# EAGLE design rapidshark-main-breakout-top-mk-1.10 (EAGLE 6.5.0)
AUTHOR: sean@yak.net
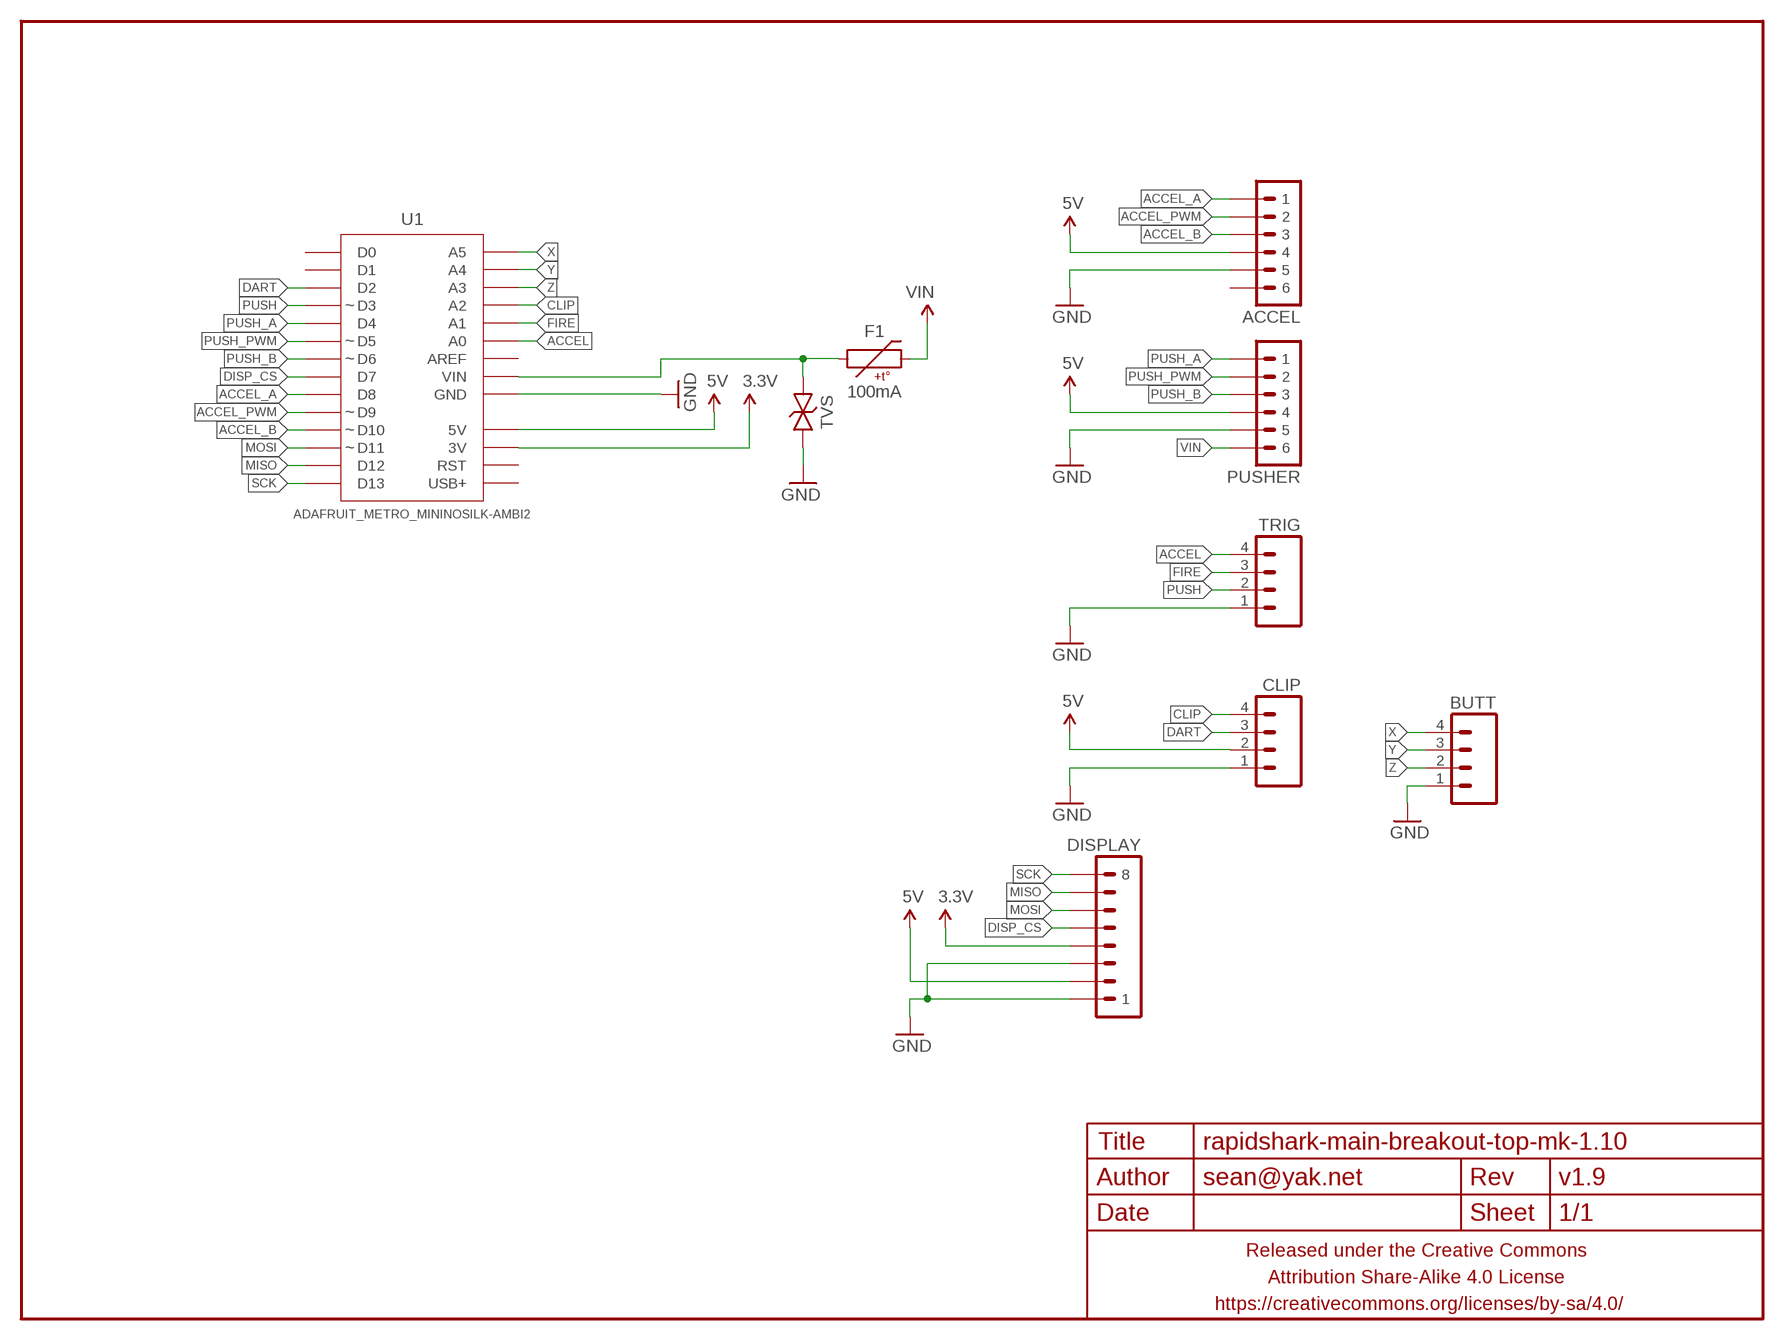
[diagram p0: schematic, sheet 1]

## Parts
ACCEL  M06JST-PH-PTH-VERT  [JST-6-PH-VERT-PTH]
BUTT  M04JST-PTH-VERT  [JST-4-PH-VERT-PTH]
CLIP  M04JST-PTH-VERT  [JST-4-PH-VERT-PTH]
DISPLAY  M08JST-PH-VERT-PTH  [JST-8-VERT-PTH]
F1  100mA  PTCSMD  [PTC-1206]
FRAME1  FRAME-LETTERNO_PACKAGE  [DUMMY]
PUSHER  M06JST-PH-PTH-VERT  [JST-6-PH-VERT-PTH]
TRIG  M04JST-PTH-VERT  [JST-4-PH-VERT-PTH]
TVS  TVSSMA  [SMA-DIODE-TVS-BIDIR]
U1  ADAFRUIT_METRO_MININOSILK-AMBI2  [ADAFRUIT_METRO_MINI_BACK]

## Nets
3.3V: DISPLAY.4 U1.17(3V)
5V: ACCEL.4 CLIP.2 DISPLAY.2 PUSHER.4 U1.18(5V)
ACCEL: TRIG.4 U1.23(A0)
ACCEL_A: ACCEL.1 U1.9(D8)
ACCEL_B: ACCEL.3 U1.11(D10)
ACCEL_PWM: ACCEL.2 U1.10(D9)
CLIP: CLIP.4 U1.25(A2)
DART: CLIP.3 U1.3(D2)
DISP_CS: DISPLAY.5 U1.8(D7)
FIRE: TRIG.3 U1.24(A1)
GND: ACCEL.5 BUTT.1 CLIP.1 DISPLAY.1 DISPLAY.3 PUSHER.5 TRIG.1 TVS.1 U1.19(GND) U1.20(GND)
MISO: DISPLAY.7 U1.13(D12)
MOSI: DISPLAY.6 U1.12(D11)
N$1: F1.1 TVS.2 U1.21(VIN)
PUSH: TRIG.2 U1.4(D3)
PUSH_A: PUSHER.1 U1.5(D4)
PUSH_B: PUSHER.3 U1.7(D6)
PUSH_PWM: PUSHER.2 U1.6(D5)
SCK: DISPLAY.8 U1.14(D13)
VIN: F1.2 PUSHER.6
X: BUTT.4 U1.28(A5)
Y: BUTT.3 U1.27(A4)
Z: BUTT.2 U1.26(A3)
Unconnected: ACCEL.6 U1.1(D0) U1.2(D1) U1.15(USB+) U1.16(RST) U1.22(AREF)

## Library data of the parts
ACCEL PUSHER = A_butts:M06: Header 6 Standard 6-pin 0.1" header. Use with straight break away headers (SKU : PRT-00116), right angle break away headers (PRT-00553), swiss pins (PRT-00743), machine pins (PRT-00117), and female headers (PRT-00115). Molex polarized connector foot print use with SKU : PRT-08094 with associated crimp pins and housings. NOTES ON THE VARIANTS LOCK and LOCK_LONGPADS... This footprint was designed to help hold the alignment of a through-hole component (i.e. 6-pin header) while soldering it into place. You may notice that each hole has been shifted either up or down by 0.005 of an inch from it's more standard position (which is a perfectly straight line). This slight alteration caused the pins (the squares in the middle) to touch the edges of the holes. Because they are alternating, it causes a "brace" to hold the component in place. 0.005 has proven to be the perfect amount of "off-center" position when using our standard breakaway headers. Although looks a little odd when you look at the bare footprint, once you have a header in there, the alteration is very hard to notice. Also,if you push a header all the way into place, it is covered up entirely on the bottom side. This idea of altering the position of holes to aid alignment will be further integrated into the Sparkfun Library for other footprints. It can help hold any component with 3 or more connection pins.
BUTT CLIP TRIG = A_butts:M04: Header 4 Standard 4-pin 0.1" header. Use with straight break away headers (SKU : PRT-00116), right angle break away headers (PRT-00553), swiss pins (PRT-00743), machine pins (PRT-00117), and female headers (PRT-00115). Molex polarized connector foot print use with SKU : PRT-08231 with associated crimp pins and housings. 1MM SMD Version SKU: PRT-10208
DISPLAY = A_butts:M08: Header 8 Standard 8-pin 0.1" header. Use with straight break away headers (SKU : PRT-00116), right angle break away headers (PRT-00553), swiss pins (PRT-00743), machine pins (PRT-00117), and female headers (PRT-00115).
F1 = A_butts:PTC: Resettable Fuse PTC Resettable Fuse. Spark Fun Electronics SKU : COM-08357; PROD_ID: RES-11150
FRAME1 = A_butts:FRAME-LETTER: Schematic Frame Standard 8.5x11 US Letter frame; DESIGNER: sean@yak.net; VERSION: v1.9
TVS = A_butts:TVS: Transient voltage suppressor- prevents ESD on inputs. Ignore package description- MBRA140 is NOT this type of part!!!
U1 = A_butts:ADAFRUIT_METRO_MINI

## Board
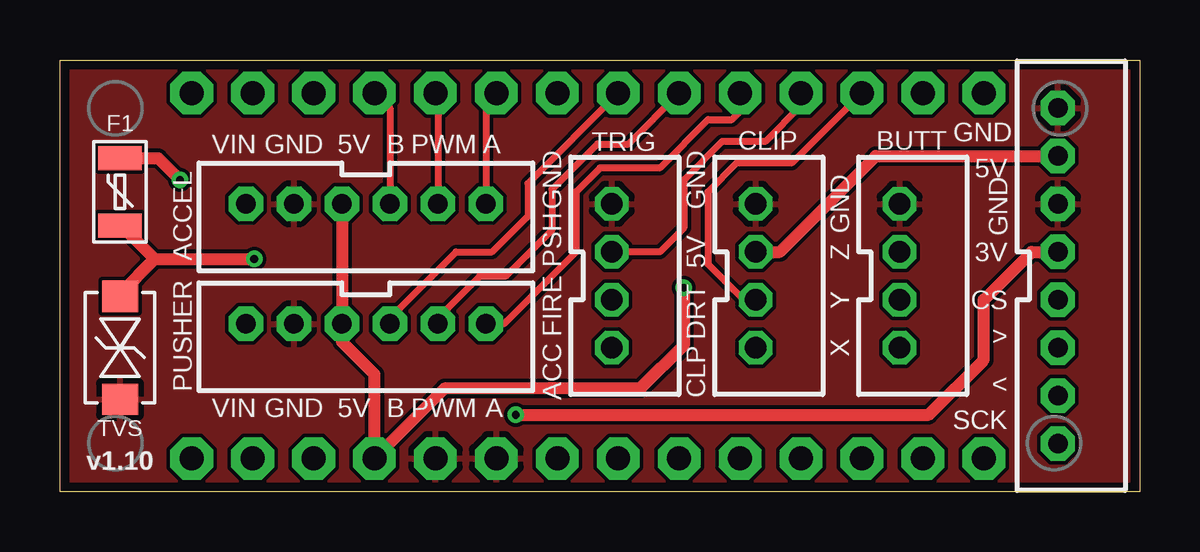
[diagram p1: board, top side]
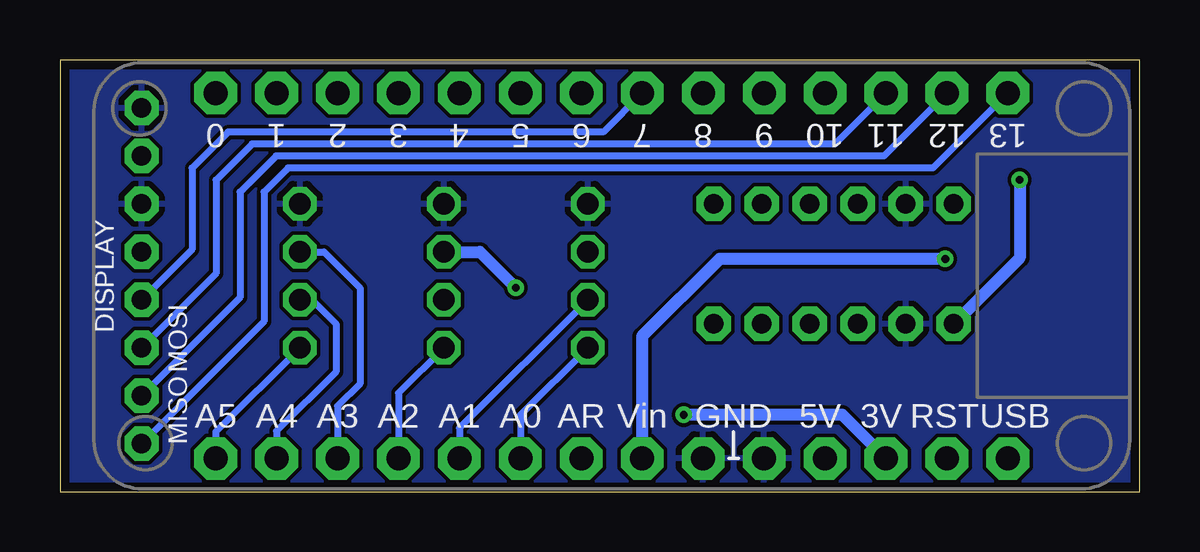
[diagram p2: board, bottom side, seen from below]

Size 45 x 18 mm. Coordinates in mm from the lower left corner, seen from the top.
Outline: 45,18 45,0 0,0 0,18 45,18
Copper layers (1*16): Top 0.0356mm / dielectric 1.5011mm / Bottom 0.0356mm
Design rules "LaenPCBOrder_2": minimum track width 6mil, minimum drill 13mil, track to track 6mil, track to pad 6mil, pad to pad 6mil, via to via 6mil, smd to smd 6mil, copper to edge 15mil, drill to drill 6mil, minimum pad ring 7mil, minimum via ring 7mil, stop-mask expansion 3mil, vias tented up to drill 20mil, thermal gap 10mil

### Footprints (pad centres in the part's own frame; a part is rotated, then mirrored left to right if it is on the bottom)
JST-6-PH-VERT-PTH = drill 0.8 pad 1.422 octagon: 1 -5,0; 2 -3,0; 3 -1,0; 4 1,0; 5 3,0; 6 5,0
JST-4-PH-VERT-PTH = drill 0.9 pad 1.4 octagon: 1 0,0; 2 2,0; 3 4,0; 4 6,0
JST-8-VERT-PTH = drill 0.8 pad 1.422 octagon: 1 -7,0; 2 -5,0; 3 -3,0; 4 -1,0; 5 1,0; 6 3,0; 7 5,0; 8 7,0
PTC-1206 = smd 1 x 1.8: 1 -1.4,0; 2 1.4,0
SMA-DIODE-TVS-BIDIR = smd 1.3 x 1.5: 1 -2.15,0; 2 2.15,0
ADAFRUIT_METRO_MINI_BACK = drill 1 pad 1.778 octagon: 1 16.51,7.62; 2 13.97,7.62; 3 11.43,7.62; 4 8.89,7.62; 5 6.35,7.62; 6 3.81,7.62; 7 1.27,7.62; 8 -1.27,7.62; 9 -3.81,7.62; 10 -6.35,7.62; 11 -8.89,7.62; 12 -11.43,7.62; 13 -13.97,7.62; 14 -16.51,7.62; 15 -16.51,-7.62; 16 -13.97,-7.62; 17 -11.43,-7.62; 18 -8.89,-7.62; 19 -6.35,-7.62; 20 -3.81,-7.62; 21 -1.27,-7.62; 22 1.27,-7.62; 23 3.81,-7.62; 24 6.35,-7.62; 25 8.89,-7.62; 26 11.43,-7.62; 27 13.97,-7.62; 28 16.51,-7.62

### Placement (x,y rotation side)
ACCEL  12.75,12 180 top
BUTT  35,12 270 top
CLIP  29,12 270 top
DISPLAY  41.6,9 270 top
F1  2.5,12.5 90 top
FRAME1  0,0 270 bottom
PUSHER  12.75,7 180 top
TRIG  23,12 270 top
TVS  2.5,6 90 top
U1  22,9 0 top

### Tracks (layer width: path | path; a pad name or v marks a point on that pad's centre or on a via)
3.3V  (via drill 0.33)
  Top 0.5: v19,3.2 36.2,3.2 38.5,5.5 38.5,8 40.5,10 DISPLAY.4
  Bottom 0.5: U1.17 12.39,3.2 v19,3.2
5V  (via drill 0.33)
  Top 0.5: CLIP.2 30,10 34,14 DISPLAY.2 | v26,8.5 26,6.1 24.2,4.3 16.03,4.3 U1.18 13.11,4.89 11.75,6.25 PUSHER.4 ACCEL.4
  Bottom 0.5: CLIP.2 27.5,10 v26,8.5
ACCEL
  Bottom 0.3: TRIG.4 25.81,3.19 U1.23
ACCEL_A
  Top 0.3: U1.9 17.75,16.18 ACCEL.1
ACCEL_B
  Top 0.3: U1.11 13.75,15.98 ACCEL.3
ACCEL_PWM
  Top 0.3: U1.10 15.75,16.52 ACCEL.2
CLIP
  Bottom 0.3: CLIP.4 30.89,4.11 U1.25
DART
  Top 0.3: U1.3 30.51,13.7 28.2,13.7 27,12.5 27,9.5 28.5,8 CLIP.3
DISP_CS
  Bottom 0.3: U1.8 22.35,15 38,15 39.5,13.5 39.5,10.1 DISPLAY.5
FIRE
  Bottom 0.3: TRIG.3 28.35,2.65 U1.24
GND
  pour Top (rank 6): 45,0 0,0 0,18 45,18
  pour Bottom (rank 6): 45,0 0,0 0,18 45,18
MISO
  Bottom 0.3: U1.13 10.65,14 36,14 37.5,12.5 37.5,8.1 DISPLAY.7
MOSI
  Bottom 0.3: U1.12 12.69,14.5 37,14.5 38.5,13 38.5,9.1 DISPLAY.6
N$1  (via drill 0.33)
  Top 0.5: 3.95,9.7 v8.1,9.7 | TVS.2 2.5,8.25 3.95,9.7 | F1.1 2.55,11.1 3.95,9.7
  Bottom 0.5: v8.1,9.7 17.5,9.7 20.73,6.47 U1.21
PUSH
  Top 0.3: U1.4 30.89,16.09 29.4,14.6 27.6,14.6 26,13 26,11 25,10 TRIG.2
PUSH_A
  Top 0.3: U1.5 28.35,15.85 28.02,15.52 27.02,15.52 25,13.5 22.5,13.5 21.5,12.5 21.5,10 18.5,7 PUSHER.1
PUSH_B
  Top 0.3: U1.7 19.5,12.85 19.5,11.5 18,10 16.5,10 13.75,7.25 PUSHER.3
PUSH_PWM
  Top 0.3: U1.6 23.7,14.5 22.4,14.5 20.5,12.6 20.5,10.9 18.6,9 17.5,9 15.75,7.25 PUSHER.2
SCK
  Bottom 0.3: U1.14 8.61,13.5 35.5,13.5 36.5,12.5 36.5,7.1 DISPLAY.8
VIN  (via drill 0.33)
  Top 0.5: F1.2 4.1,13.9 v5,13
  Bottom 0.5: v5,13 5,9.75 PUSHER.6
X
  Bottom 0.3: BUTT.4 38.51,2.49 U1.28
Y
  Bottom 0.3: U1.27 35.97,2.53 33.5,5 33.5,7 34.5,8 BUTT.3
Z
  Bottom 0.3: BUTT.2 34,10 32.5,8.5 32.5,4.5 33.43,3.57 U1.26

### Text on the board
tPlace: GND | VIN | GND | 5V | B | PWM | A | 5V | GND | GND | GND | GND | PSH | 5V | Z | 3V | FIRE | DRT | Y | CS | X | > | ACC | CLP | VIN | GND | 5V | B | PWM | A | < | SCK
bPlace: MOSI | MISO